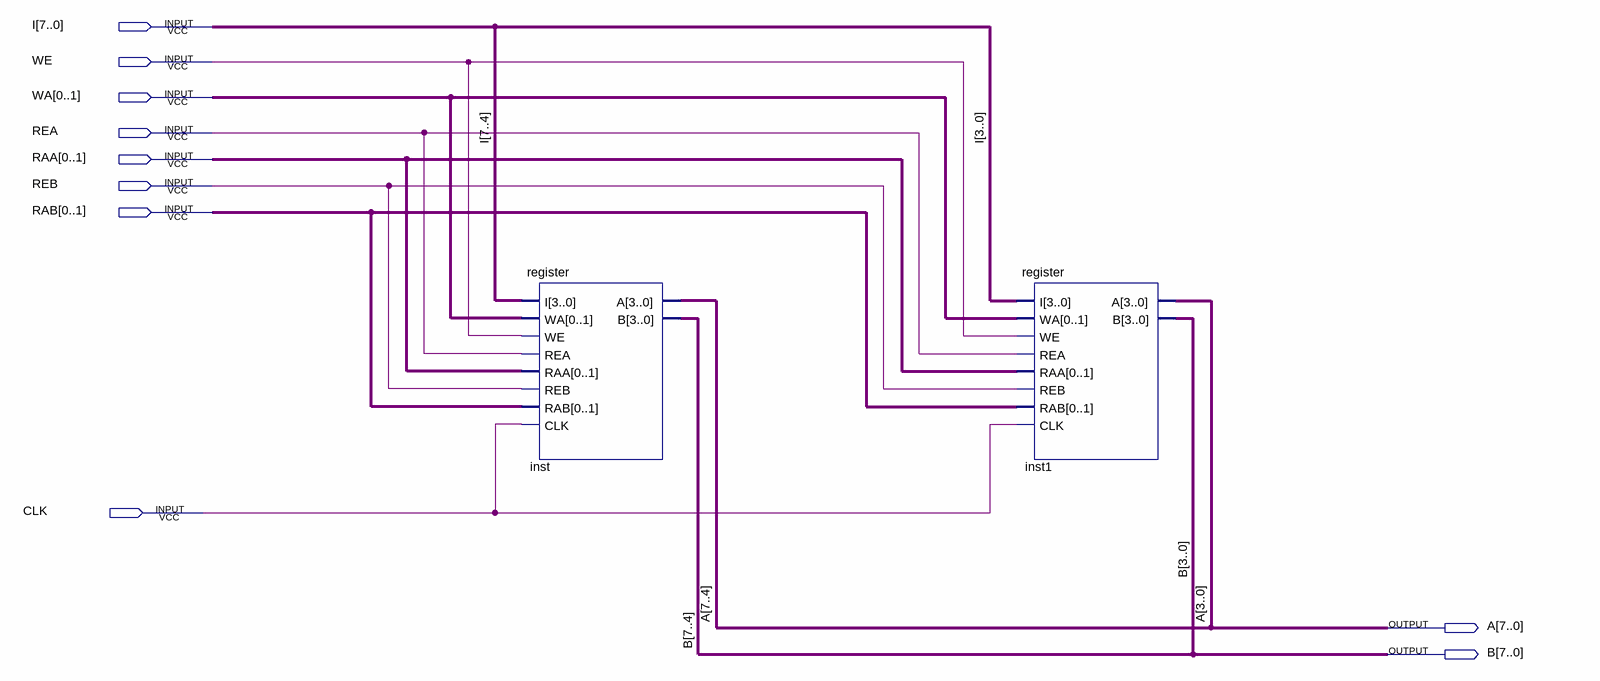
[diagram p0: schematic sheet]
// Quartus schematic Register_4x8.bdf as structural Verilog: 2 symbols, 10 pins
module Register_4x8 (
  input  [7:0] I,
  input  WE,
  input  [0:1] WA,
  input  REA,
  input  [0:1] RAA,
  input  REB,
  input  [0:1] RAB,
  input  CLK,
  output [7:0] A,
  output [7:0] B
);

  register inst (
    .I(I[7:4]), .WA(WA), .WE(WE), .REA(REA), .RAA(RAA), .REB(REB), .RAB(RAB), .CLK(CLK), .A(A[7:4]),
    .B(B[7:4]));
  register inst1 (
    .I(I[3:0]), .WA(WA), .WE(WE), .REA(REA), .RAA(RAA), .REB(REB), .RAB(RAB), .CLK(CLK), .A(A[3:0]),
    .B(B[3:0]));
endmodule
